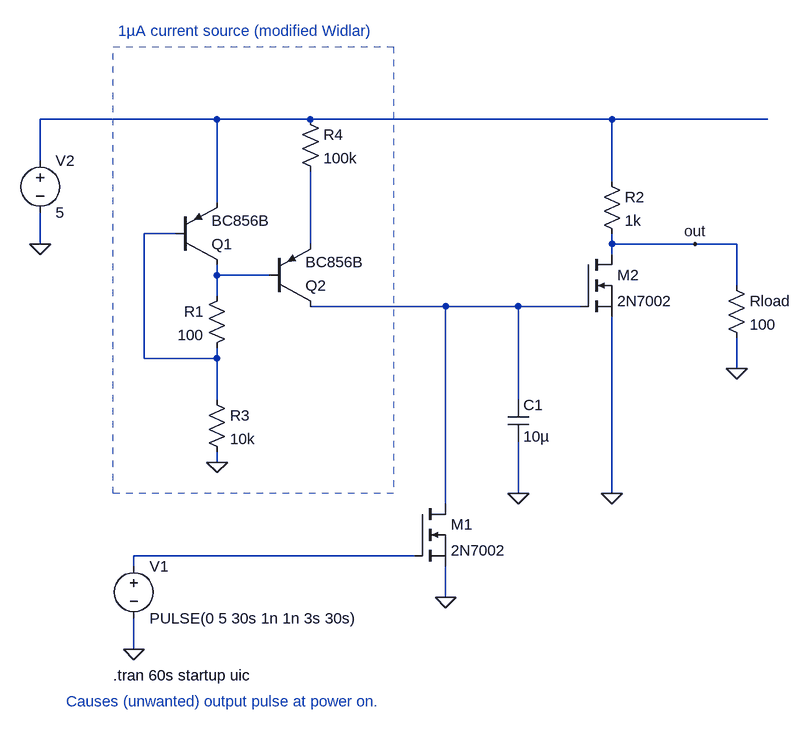
[diagram p0: schematic discrete2.asc]
discrete2.asc, the LTspice schematic file:
Version 4
SHEET 1 2056 704
WIRE -256 -208 -528 -208
WIRE -112 -208 -256 -208
WIRE 352 -208 -112 -208
WIRE 592 -208 352 -208
WIRE -528 -144 -528 -208
WIRE 352 -112 352 -208
WIRE -256 -80 -256 -208
WIRE -320 -32 -368 -32
WIRE -528 -16 -528 -64
WIRE -112 -16 -112 -128
WIRE 352 -16 352 -32
WIRE 480 -16 352 -16
WIRE 544 -16 480 -16
WIRE 352 0 352 -16
WIRE -256 32 -256 16
WIRE -176 32 -256 32
WIRE 544 48 544 -16
WIRE -256 64 -256 32
WIRE 96 80 -112 80
WIRE 208 80 96 80
WIRE 304 80 208 80
WIRE -368 160 -368 -32
WIRE -256 160 -256 144
WIRE -256 160 -368 160
WIRE 544 176 544 128
WIRE -256 224 -256 160
WIRE 208 224 208 80
WIRE -256 320 -256 304
WIRE 208 368 208 288
WIRE 352 368 352 96
WIRE 96 384 96 80
WIRE 48 464 -384 464
WIRE -384 480 -384 464
WIRE 96 528 96 480
WIRE -384 608 -384 560
FLAG 96 528 0
FLAG 352 368 0
FLAG -528 -16 0
FLAG -384 608 0
FLAG 208 368 0
FLAG -256 320 0
FLAG 480 -16 out
FLAG 544 176 0
SYMBOL nmos 48 384 R0
SYMATTR InstName M1
SYMATTR Value 2N7002
SYMBOL nmos 304 0 R0
SYMATTR InstName M2
SYMATTR Value 2N7002
SYMBOL voltage -384 464 R0
WINDOW 123 0 0 Left 0
WINDOW 39 0 0 Left 0
SYMATTR InstName V1
SYMATTR Value PULSE(0 5 30s 1n 1n 3s 30s)
SYMBOL voltage -528 -160 R0
SYMATTR InstName V2
SYMATTR Value 5
SYMBOL cap 192 224 R0
SYMATTR InstName C1
SYMATTR Value 10µ
SYMBOL res 336 -128 R0
SYMATTR InstName R2
SYMATTR Value 1k
SYMBOL pnp -320 16 M180
SYMATTR InstName Q1
SYMATTR Value BC856B
SYMBOL pnp -176 80 M180
SYMATTR InstName Q2
SYMATTR Value BC856B
SYMBOL res -240 48 M0
SYMATTR InstName R1
SYMATTR Value 100
SYMBOL res -272 208 R0
SYMATTR InstName R3
SYMATTR Value 10k
SYMBOL res -128 -224 R0
SYMATTR InstName R4
SYMATTR Value 100k
SYMBOL res 528 32 R0
SYMATTR InstName Rload
SYMATTR Value 100
TEXT -416 648 Left 2 !.tran 60s startup uic
TEXT -408 -344 Left 2 ;1µA current source (modified Widlar)
TEXT -488 688 Left 2 ;Causes (unwanted) output pulse at power on.
RECTANGLE Normal 16 368 -416 -320 2

The netlist it stands for:
* discrete2.asc
M1 N005 N006 0 0 2N7002
M2 out N005 0 0 2N7002
V1 N006 0 PULSE(0 5 30s 1n 1n 3s 30s)
V2 N001 0 5
C1 N005 0 10µ
R2 N001 out 1k
Q1 N004 N002 N001 0 BC856B
Q2 N005 N004 N003 0 BC856B
R1 N004 N002 100
R3 N002 0 10k
R4 N001 N003 100k
Rload out 0 100
.model NPN NPN
.model PNP PNP
.lib standard.bjt
.model NMOS NMOS
.model PMOS PMOS
.lib standard.mos
.tran 60s startup uic
* 1µA current source (modified Widlar)
* Causes (unwanted) output pulse at power on.
.backanno
.end